# Altium schematic sheet Toppers_Pizza.SchDoc
size A
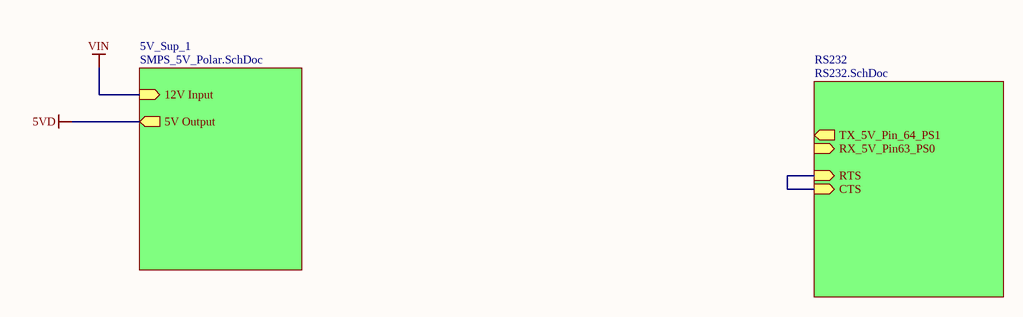
[diagram p0: Toppers_Pizza.SchDoc]

## Sub-sheets
5V_Sup_1 = SMPS_5V_Polar.SchDoc: 5V Output (out), 12V Input (in)
RS232 = RS232.SchDoc: TX_5V_Pin_64_PS1 (out), RX_5V_Pin63_PS0 (in), RTS (in), CTS (in)

## Nets
5VD: sheet 5V_Sup_1/5V Output
VIN: sheet 5V_Sup_1/12V Input
(unnamed): sheet RS232/RTS, sheet RS232/CTS